# EAGLE design Supercaps25F (EAGLE 7.1.0)
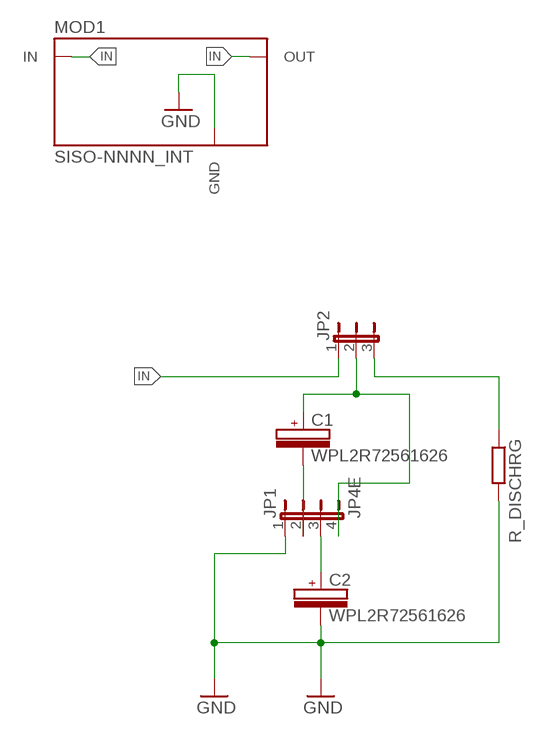
[diagram p0: schematic, sheet 1]

## Parts
C1  WPL2R72561626  [DLC_16X26]
C2  WPL2R72561626  [DLC_16X26]
JP1  JP4E  [JP4]
JP2  JP2E  [JP2]
MOD1  SISO-NNNN_INT  [SISO-NNNN]
R_DISCHRG  R_THROUGH-HOLE  [R_THROUGH-HOLE]

## Nets
GND: C2.2 JP1.1 MOD1.GND1(GND) MOD1.GND2(GND) MOD1.GND3(GND) MOD1.GND4(GND) R_DISCHRG.2
IN: JP2.1 MOD1.IN1(IN) MOD1.IN2(IN) MOD1.IN3(IN) MOD1.IN4(IN) MOD1.OUT1(OUT) MOD1.OUT2(OUT) MOD1.OUT3(OUT) MOD1.OUT4(OUT)
N$2: C1.2 JP1.2
N$3: C2.1 JP1.3
N$4: C1.1 JP1.4 JP2.2
N$6: JP2.3 R_DISCHRG.1

## Library data of the parts
C1 C2 = SUPERCAPACITOR:WPL2R72561626
JP1 = Jumper_mod:JP4E
JP2 = Jumper_mod:JP2E: JUMPER
MOD1 = AllModules:SISO-NNNN_INT
R_DISCHRG = Resistor:R_THROUGH-HOLE

## Board
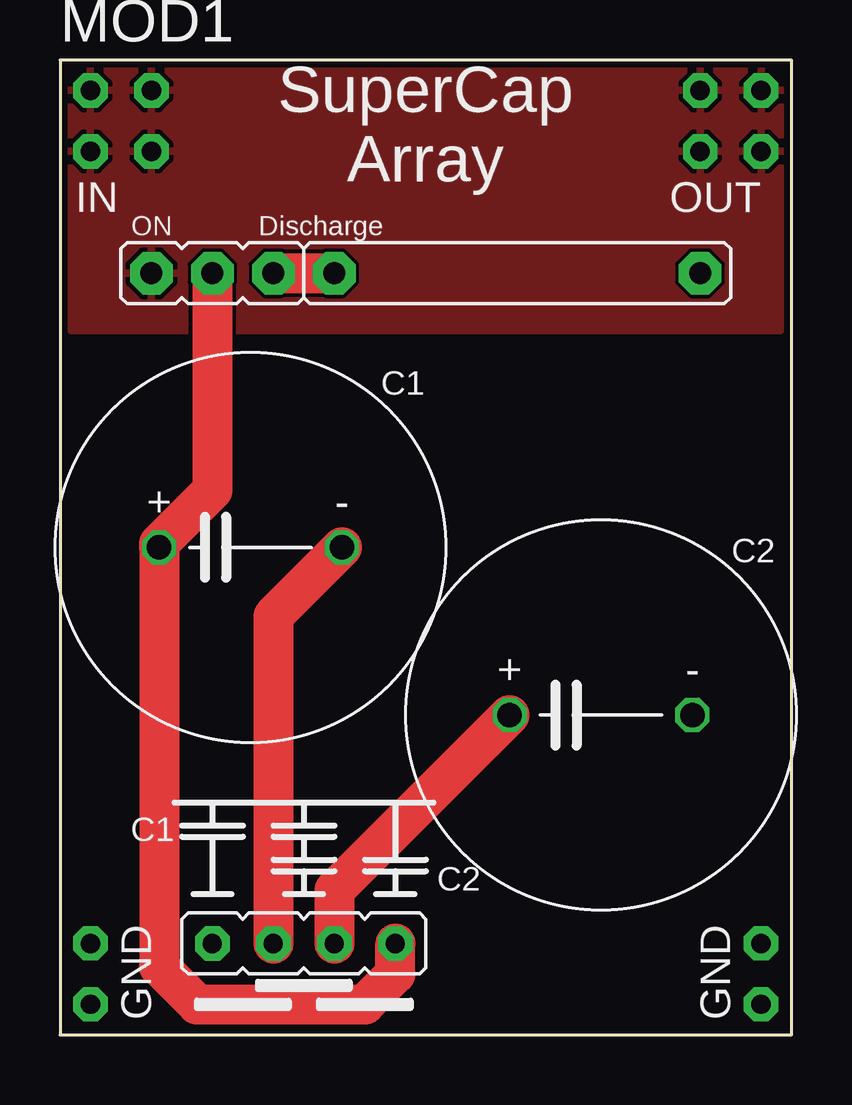
[diagram p1: board, top side]
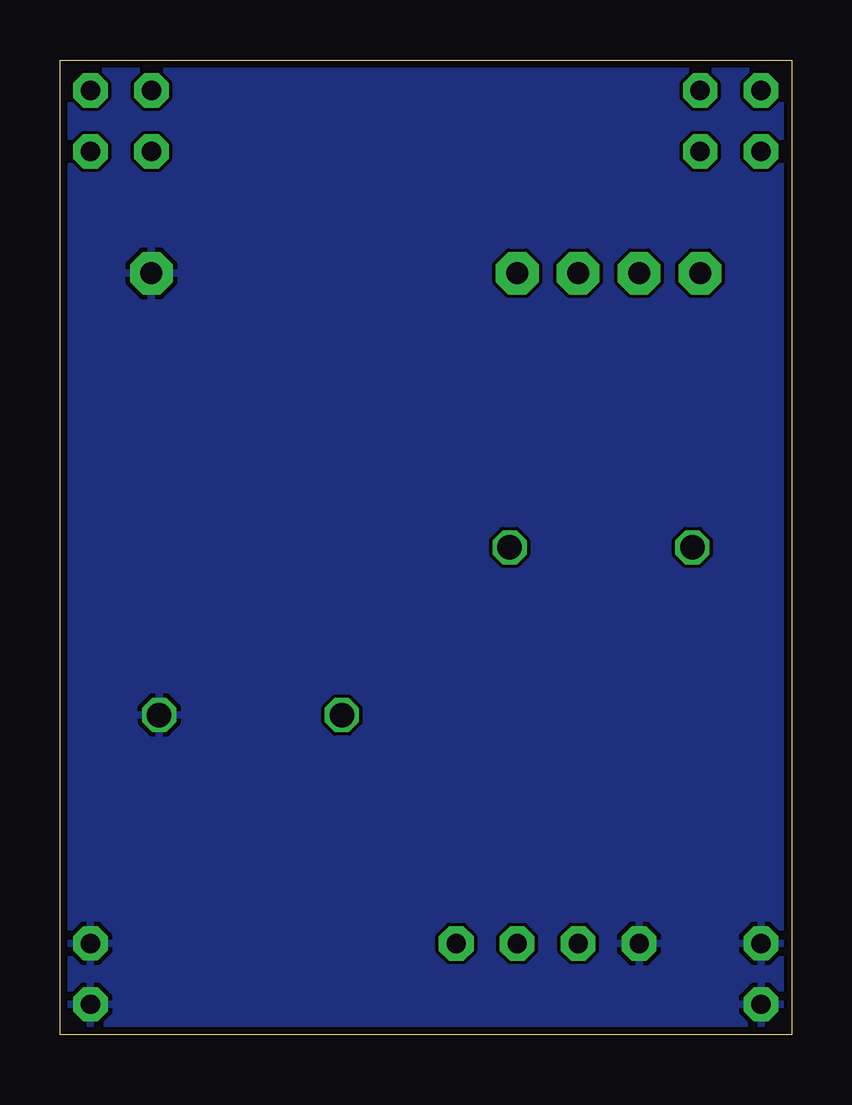
[diagram p2: board, bottom side, seen from below]

Size 30.48 x 40.64 mm. Coordinates in mm from the lower left corner, seen from the top.
Outline: 0,0 30.48,0 30.48,40.64 0,40.64 0,0
Copper layers (1*16): Top 0.035mm / dielectric 1.5mm / Bottom 0.035mm
Design rules "PCB-POOL Standard *": minimum track width 0.15mm, minimum drill 0.3mm, track to track 0.15mm, track to pad 0.15mm, pad to pad 0.15mm, via to via 0.15mm, smd to smd 0.15mm, copper to edge 0.3mm, drill to drill 0.2mm, minimum pad ring 0.2mm, minimum via ring 0.15mm, stop-mask expansion 0.075mm, vias tented up to drill 0mil, thermal gap 0.2mm

### Footprints (pad centres in the part's own frame; a part is rotated, then mirrored left to right if it is on the bottom)
DLC_16X26 = drill 1.016 octagon: 1 -3.81,0; 2 3.81,0
JP4 = drill 0.8 pad 1.44 octagon: 1 -3.81,0; 2 -1.27,0; 3 1.27,0; 4 3.81,0
JP2 = drill 0.914 pad 1.778 octagon: 1 -2.54,0; 2 0,0; 3 2.54,0
SISO-NNNN = drill 0.8 pad 1.422 octagon: GND1 0,-38.1; GND2 0,-35.56; GND3 27.94,-35.56; GND4 27.94,-38.1; IN1 0,0; IN2 0,-2.54; IN3 2.54,0; IN4 2.54,-2.54; OUT1 25.4,0; OUT2 25.4,-2.54; OUT3 27.94,0; OUT4 27.94,-2.54
R_THROUGH-HOLE = drill 0.914 pad 1.778 octagon: 1 -8.89,0; 2 6.35,0

### Placement (x,y rotation side)
C1  7.94,20.32 0 top
C2  22.54,13.33 0 top
JP1  10.16,3.81 0 top
JP2  6.35,31.75 0 top
MOD1  1.27,39.37 0 top
R_DISCHRG  20.32,31.75 0 top

### Tracks (layer width: path | path; a pad name or v marks a point on that pad's centre or on a via)
GND
  pour Bottom (rank 2): 0.48,40.16 0.48,0.48 30,0.48 30,40.16
IN
  pour Top (rank 2): 0.48,40.16 0.48,29.37 30,29.37 30,40.16
N$2
  Top 1.676: C1.2 8.89,17.46 JP1.2
N$3
  Top 1.676: C2.1 11.43,6.03 JP1.3
N$4
  Top 1.676: JP2.2 6.35,22.7 4.13,20.48 C1.1 4.13,2.86 5.71,1.27 12.7,1.27 13.97,2.54 JP1.4
N$6
  Top 1.676: JP2.3 R_DISCHRG.1

### Text on the board
tNames: SuperCap / Array | ON | Discharge | C1 | C2
bStop: by Kokert & Beckedahl / 25.04.2017